# EAGLE design zif_generic (EAGLE 9.6.2)
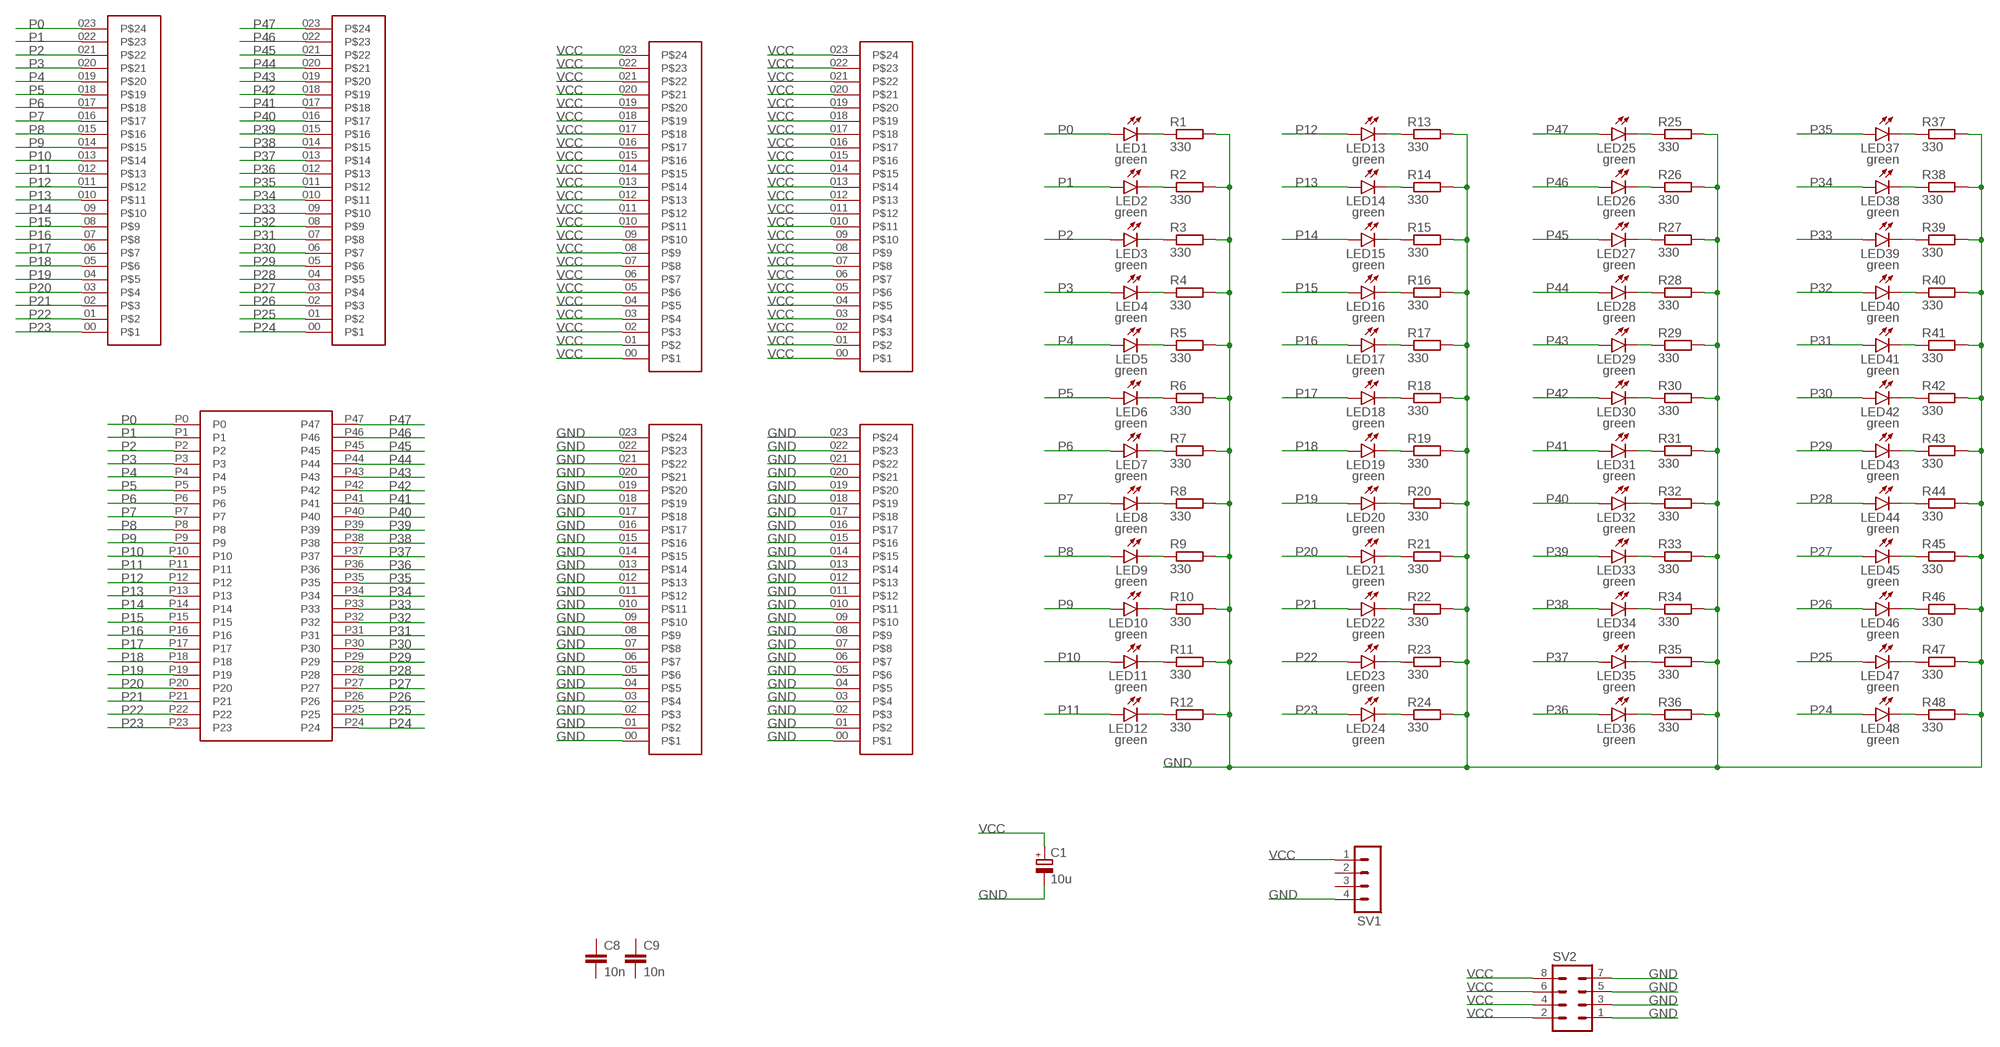
[diagram p0: schematic, sheet 1]

## Parts
C1  10u  CPOL-EUE5-8.5  [E5-8,5]
C8  10n  C-EU050-025X075  [C050-025X075]
C9  10n  C-EU050-025X075  [C050-025X075]
LED1  green  LEDSML1206  [SML1206]
LED2  green  LEDSML1206  [SML1206]
LED3  green  LEDSML1206  [SML1206]
LED4  green  LEDSML1206  [SML1206]
LED5  green  LEDSML1206  [SML1206]
LED6  green  LEDSML1206  [SML1206]
LED7  green  LEDSML1206  [SML1206]
LED8  green  LEDSML1206  [SML1206]
LED9  green  LEDSML1206  [SML1206]
LED10  green  LEDSML1206  [SML1206]
LED11  green  LEDSML1206  [SML1206]
LED12  green  LEDSML1206  [SML1206]
LED13  green  LEDSML1206  [SML1206]
LED14  green  LEDSML1206  [SML1206]
LED15  green  LEDSML1206  [SML1206]
LED16  green  LEDSML1206  [SML1206]
LED17  green  LEDSML1206  [SML1206]
LED18  green  LEDSML1206  [SML1206]
LED19  green  LEDSML1206  [SML1206]
LED20  green  LEDSML1206  [SML1206]
LED21  green  LEDSML1206  [SML1206]
LED22  green  LEDSML1206  [SML1206]
LED23  green  LEDSML1206  [SML1206]
LED24  green  LEDSML1206  [SML1206]
LED25  green  LEDSML1206  [SML1206]
LED26  green  LEDSML1206  [SML1206]
LED27  green  LEDSML1206  [SML1206]
LED28  green  LEDSML1206  [SML1206]
LED29  green  LEDSML1206  [SML1206]
LED30  green  LEDSML1206  [SML1206]
LED31  green  LEDSML1206  [SML1206]
LED32  green  LEDSML1206  [SML1206]
LED33  green  LEDSML1206  [SML1206]
LED34  green  LEDSML1206  [SML1206]
LED35  green  LEDSML1206  [SML1206]
LED36  green  LEDSML1206  [SML1206]
LED37  green  LEDSML1206  [SML1206]
LED38  green  LEDSML1206  [SML1206]
LED39  green  LEDSML1206  [SML1206]
LED40  green  LEDSML1206  [SML1206]
LED41  green  LEDSML1206  [SML1206]
LED42  green  LEDSML1206  [SML1206]
LED43  green  LEDSML1206  [SML1206]
LED44  green  LEDSML1206  [SML1206]
LED45  green  LEDSML1206  [SML1206]
LED46  green  LEDSML1206  [SML1206]
LED47  green  LEDSML1206  [SML1206]
LED48  green  LEDSML1206  [SML1206]
R1  330  R-EU_R0805  [R0805]
R2  330  R-EU_R0805  [R0805]
R3  330  R-EU_R0805  [R0805]
R4  330  R-EU_R0805  [R0805]
R5  330  R-EU_R0805  [R0805]
R6  330  R-EU_R0805  [R0805]
R7  330  R-EU_R0805  [R0805]
R8  330  R-EU_R0805  [R0805]
R9  330  R-EU_R0805  [R0805]
R10  330  R-EU_R0805  [R0805]
R11  330  R-EU_R0805  [R0805]
R12  330  R-EU_R0805  [R0805]
R13  330  R-EU_R0805  [R0805]
R14  330  R-EU_R0805  [R0805]
R15  330  R-EU_R0805  [R0805]
R16  330  R-EU_R0805  [R0805]
R17  330  R-EU_R0805  [R0805]
R18  330  R-EU_R0805  [R0805]
R19  330  R-EU_R0805  [R0805]
R20  330  R-EU_R0805  [R0805]
R21  330  R-EU_R0805  [R0805]
R22  330  R-EU_R0805  [R0805]
R23  330  R-EU_R0805  [R0805]
R24  330  R-EU_R0805  [R0805]
R25  330  R-EU_R0805  [R0805]
R26  330  R-EU_R0805  [R0805]
R27  330  R-EU_R0805  [R0805]
R28  330  R-EU_R0805  [R0805]
R29  330  R-EU_R0805  [R0805]
R30  330  R-EU_R0805  [R0805]
R31  330  R-EU_R0805  [R0805]
R32  330  R-EU_R0805  [R0805]
R33  330  R-EU_R0805  [R0805]
R34  330  R-EU_R0805  [R0805]
R35  330  R-EU_R0805  [R0805]
R36  330  R-EU_R0805  [R0805]
R37  330  R-EU_R0805  [R0805]
R38  330  R-EU_R0805  [R0805]
R39  330  R-EU_R0805  [R0805]
R40  330  R-EU_R0805  [R0805]
R41  330  R-EU_R0805  [R0805]
R42  330  R-EU_R0805  [R0805]
R43  330  R-EU_R0805  [R0805]
R44  330  R-EU_R0805  [R0805]
R45  330  R-EU_R0805  [R0805]
R46  330  R-EU_R0805  [R0805]
R47  330  R-EU_R0805  [R0805]
R48  330  R-EU_R0805  [R0805]
SV1  MA04-1  [MA04-1]
SV2  MA04-2  [MA04-2]
U$1  PIN_1X24  [PIN_1X24]
U$2  PIN_1X24  [PIN_1X24]
U$3  PIN_1X24  [PIN_1X24]
U$4  PIN_1X24  [PIN_1X24]
U$5  PIN_1X24  [PIN_1X24]
U$6  PIN_1X24  [PIN_1X24]
U$7  ZIF_24X2  [ZIF_24X2]

## Nets
GND [Supply]: C1.- R1.2 R2.2 R3.2 R4.2 R5.2 R6.2 R7.2 R8.2 R9.2 R10.2 R11.2 R12.2 R13.2 R14.2 R15.2 R16.2 R17.2 R18.2 R19.2 R20.2 R21.2 R22.2 R23.2 R24.2 R25.2 R26.2 R27.2 R28.2 R29.2 R30.2 R31.2 R32.2 R33.2 R34.2 R35.2 R36.2 R37.2 R38.2 R39.2 R40.2 R41.2 R42.2 R43.2 R44.2 R45.2 R46.2 R47.2 R48.2 SV1.4 SV2.1 SV2.3 SV2.5 SV2.7 U$2.00 U$2.01 U$2.02 U$2.03 U$2.04 U$2.05 U$2.06 U$2.07 U$2.08 U$2.09 U$2.010 U$2.011 U$2.012 U$2.013 U$2.014 U$2.015 U$2.016 U$2.017 U$2.018 U$2.019 U$2.020 U$2.021 U$2.022 U$2.023 U$5.00 U$5.01 U$5.02 U$5.03 U$5.04 U$5.05 U$5.06 U$5.07 U$5.08 U$5.09 U$5.010 U$5.011 U$5.012 U$5.013 U$5.014 U$5.015 U$5.016 U$5.017 U$5.018 U$5.019 U$5.020 U$5.021 U$5.022 U$5.023
N$1: LED1.C R1.1
N$2: LED2.C R2.1
N$3: LED3.C R3.1
N$4: LED4.C R4.1
N$5: LED5.C R5.1
N$6: LED6.C R6.1
N$7: LED7.C R7.1
N$8: LED8.C R8.1
N$9: LED9.C R9.1
N$10: LED10.C R10.1
N$11: LED11.C R11.1
N$12: LED12.C R12.1
N$13: LED13.C R13.1
N$14: LED14.C R14.1
N$15: LED15.C R15.1
N$16: LED16.C R16.1
N$17: LED17.C R17.1
N$18: LED18.C R18.1
N$19: LED19.C R19.1
N$20: LED20.C R20.1
N$21: LED21.C R21.1
N$22: LED22.C R22.1
N$23: LED23.C R23.1
N$24: LED24.C R24.1
N$25: LED25.C R25.1
N$26: LED26.C R26.1
N$27: LED27.C R27.1
N$28: LED28.C R28.1
N$29: LED29.C R29.1
N$30: LED30.C R30.1
N$31: LED31.C R31.1
N$32: LED32.C R32.1
N$33: LED33.C R33.1
N$34: LED34.C R34.1
N$35: LED35.C R35.1
N$36: LED36.C R36.1
N$37: LED37.C R37.1
N$38: LED38.C R38.1
N$39: LED39.C R39.1
N$40: LED40.C R40.1
N$41: LED41.C R41.1
N$42: LED42.C R42.1
N$43: LED43.C R43.1
N$44: LED44.C R44.1
N$45: LED45.C R45.1
N$46: LED46.C R46.1
N$47: LED47.C R47.1
N$48: LED48.C R48.1
P0: LED1.A U$4.023 U$7.P0
P1: LED2.A U$4.022 U$7.P1
P2: LED3.A U$4.021 U$7.P2
P3: LED4.A U$4.020 U$7.P3
P4: LED5.A U$4.019 U$7.P4
P5: LED6.A U$4.018 U$7.P5
P6: LED7.A U$4.017 U$7.P6
P7: LED8.A U$4.016 U$7.P7
P8: LED9.A U$4.015 U$7.P8
P9: LED10.A U$4.014 U$7.P9
P10: LED11.A U$4.013 U$7.P10
P11: LED12.A U$4.012 U$7.P11
P12: LED13.A U$4.011 U$7.P12
P13: LED14.A U$4.010 U$7.P13
P14: LED15.A U$4.09 U$7.P14
P15: LED16.A U$4.08 U$7.P15
P16: LED17.A U$4.07 U$7.P16
P17: LED18.A U$4.06 U$7.P17
P18: LED19.A U$4.05 U$7.P18
P19: LED20.A U$4.04 U$7.P19
P20: LED21.A U$4.03 U$7.P20
P21: LED22.A U$4.02 U$7.P21
P22: LED23.A U$4.01 U$7.P22
P23: LED24.A U$4.00 U$7.P23
P24: LED48.A U$1.00 U$7.P24
P25: LED47.A U$1.01 U$7.P25
P26: LED46.A U$1.02 U$7.P26
P27: LED45.A U$1.03 U$7.P27
P28: LED44.A U$1.04 U$7.P28
P29: LED43.A U$1.05 U$7.P29
P30: LED42.A U$1.06 U$7.P30
P31: LED41.A U$1.07 U$7.P31
P32: LED40.A U$1.08 U$7.P32
P33: LED39.A U$1.09 U$7.P33
P34: LED38.A U$1.010 U$7.P34
P35: LED37.A U$1.011 U$7.P35
P36: LED36.A U$1.012 U$7.P36
P37: LED35.A U$1.013 U$7.P37
P38: LED34.A U$1.014 U$7.P38
P39: LED33.A U$1.015 U$7.P39
P40: LED32.A U$1.016 U$7.P40
P41: LED31.A U$1.017 U$7.P41
P42: LED30.A U$1.018 U$7.P42
P43: LED29.A U$1.019 U$7.P43
P44: LED28.A U$1.020 U$7.P44
P45: LED27.A U$1.021 U$7.P45
P46: LED26.A U$1.022 U$7.P46
P47: LED25.A U$1.023 U$7.P47
VCC [Supply]: C1.+ SV1.1 SV2.2 SV2.4 SV2.6 SV2.8 U$3.00 U$3.01 U$3.02 U$3.03 U$3.04 U$3.05 U$3.06 U$3.07 U$3.08 U$3.09 U$3.010 U$3.011 U$3.012 U$3.013 U$3.014 U$3.015 U$3.016 U$3.017 U$3.018 U$3.019 U$3.020 U$3.021 U$3.022 U$3.023 U$6.00 U$6.01 U$6.02 U$6.03 U$6.04 U$6.05 U$6.06 U$6.07 U$6.08 U$6.09 U$6.010 U$6.011 U$6.012 U$6.013 U$6.014 U$6.015 U$6.016 U$6.017 U$6.018 U$6.019 U$6.020 U$6.021 U$6.022 U$6.023
Unconnected: C8.1 C8.2 C9.1 C9.2 SV1.2 SV1.3

## Library data of the parts
C1 = rcl:CPOL-EU: POLARIZED CAPACITOR, European symbol; SPICEPREFIX: C
C8 C9 = rcl:C-EU: CAPACITOR, European symbol; SPICEPREFIX: C
LED1-LED48 = led:LED: LED OSRAM: - CHIPLED LG R971, LG N971, LY N971, LG Q971, LY Q971, LO R971, LY R971 LH N974, LH R974 LS Q976, LO Q976, LY Q976 LO Q996 - Hyper CHIPLED LW Q18S LB Q993, LB Q99A, LB R99A - SideLED LS A670, LO A670, LY A670, LG A670, LP A670 LB A673, LV A673, LT A673, LW A673 LH A674 LY A675 LS A676, LA A676, LO A676, LY A676, LW A676 LS A679, LY A679, LG A679 - Hyper Micro SIDELED® LS Y876, LA Y876, LO Y876, LY Y876 LT Y87S - SmartLED LW L88C, LW L88S LB L89C, LB L89S, LG L890 LS L89K, LO L89K, LY L89K LS L896, LA L896, LO L896, LY L896 - TOPLED LS T670, LO T670, LY T670, LG T670, LP T670 LSG T670, LSP T670, LSY T670, LOP T670, LYG T670 LG T671, LOG T671, LSG T671 LB T673, LV T673, LT T673, LW T673 LH T674 LS T676, LA T676, LO T676, LY T676, LB T676, LH T676, LSB T676, LW T676 LB T67C, LV T67C, LT T67C, LS T67K, LO T67K, LY T67K, LW E67C LS E67B, LA E67B, LO E67B, LY E67B, LB E67C, LV E67C, LT E67C LW T67C LS T679, LY T679, LG T679 LS T770, LO T770, LY T770, LG T770, LP T770 LB T773, LV T773, LT T773, LW T773 LH T774 LS E675, LA E675, LY E675, LS T675 LS T776, LA T776, LO T776, LY T776, LB T776 LHGB T686 LT T68C, LB T68C - Hyper Mini TOPLED® LB M676 - Mini TOPLED Santana® LG M470 LS M47K, LO M47K, LY M47K Source: http://www.osram.convergy.de LUXEON: - LUMILED® LXK2-PW12-R00, LXK2-PW12-S00, LXK2-PW14-U00, LXK2-PW14-V00 LXK2-PM12-R00, LXK2-PM12-S00, LXK2-PM14-U00 LXK2-PE12-Q00, LXK2-PE12-R00, LXK2-PE12-S00, LXK2-PE14-T00, LXK2-PE14-U00 LXK2-PB12-K00, LXK2-PB12-L00, LXK2-PB12-M00, LXK2-PB14-N00, LXK2-PB14-P00, LXK2-PB14-Q00 LXK2-PR12-L00, LXK2-PR12-M00, LXK2-PR14-Q00, LXK2-PR14-R00 LXK2-PD12-Q00, LXK2-PD12-R00, LXK2-PD12-S00 LXK2-PH12-R00, LXK2-PH12-S00 LXK2-PL12-P00, LXK2-PL12-Q00, LXK2-PL12-R00 Source: www.luxeon.com KINGBRIGHT: KA-3528ASYC Source: www.kingbright.com
R1-R48 = rcl:R-EU_: RESISTOR, European symbol; SPICEPREFIX: R
SV1 = con-lstb:MA04-1: PIN HEADER; OC_FARNELL: unknown; OC_NEWARK: unknown
SV2 = con-lstb:MA04-2: PIN HEADER; OC_FARNELL: unknown; OC_NEWARK: unknown
U$1-U$6 = IsaacAlonso:PIN_1X24
U$7 = IsaacAlonso:ZIF_24X2

## Net classes
1 Supply: width 1.27 mm

## Board
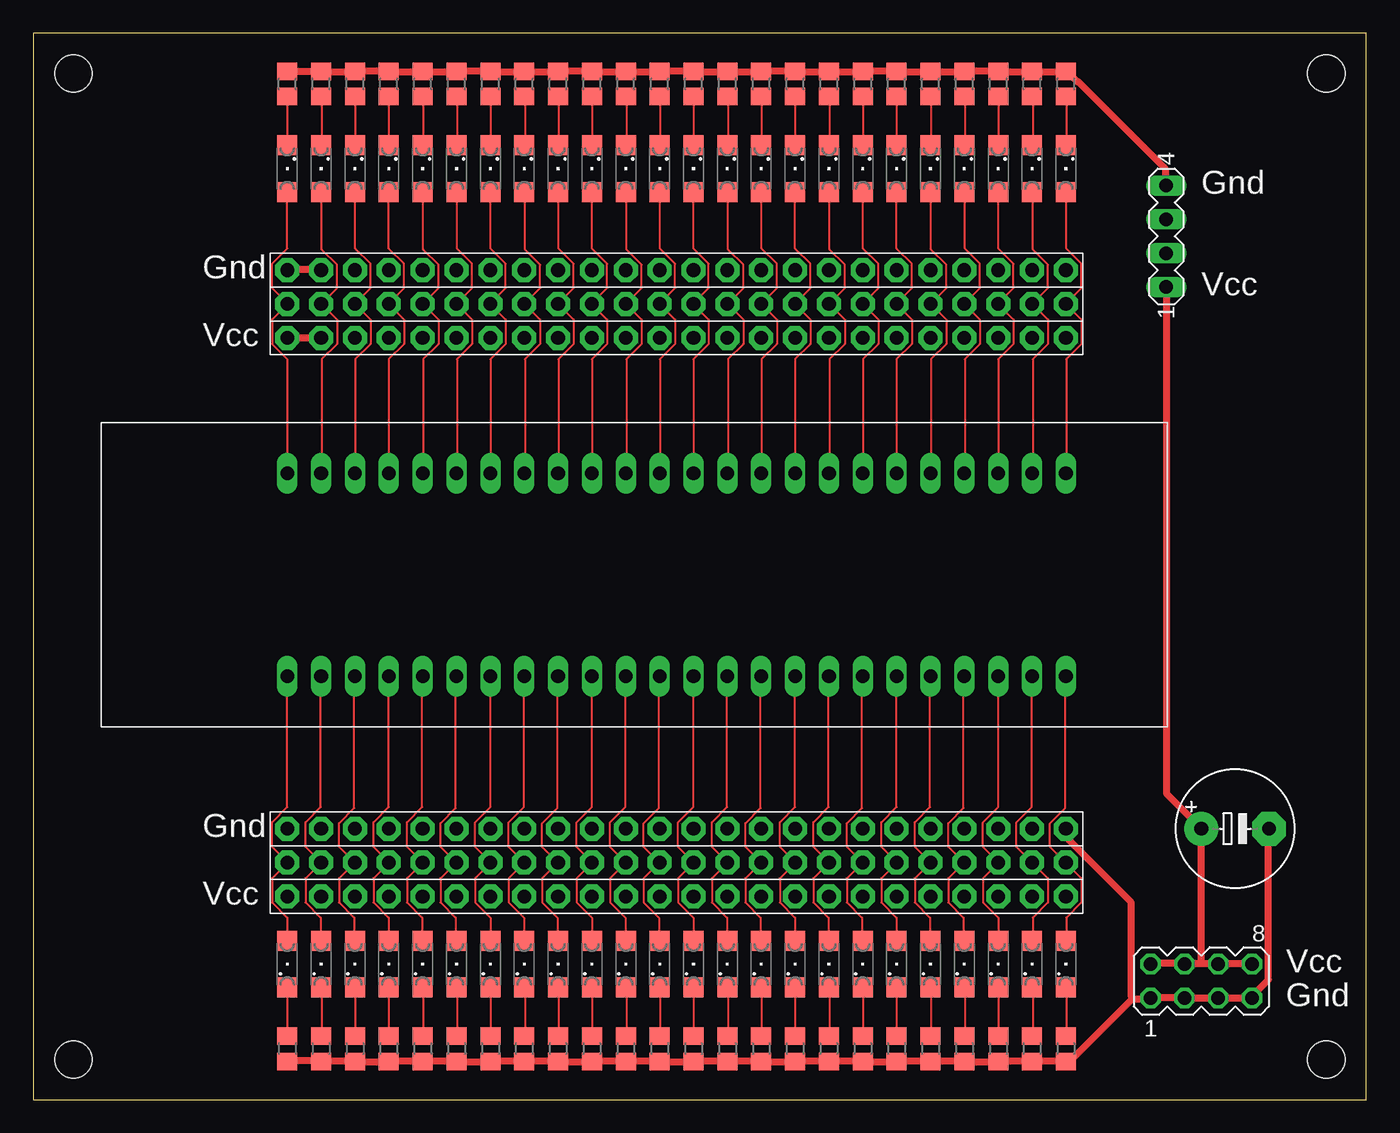
[diagram p1: board, top side]
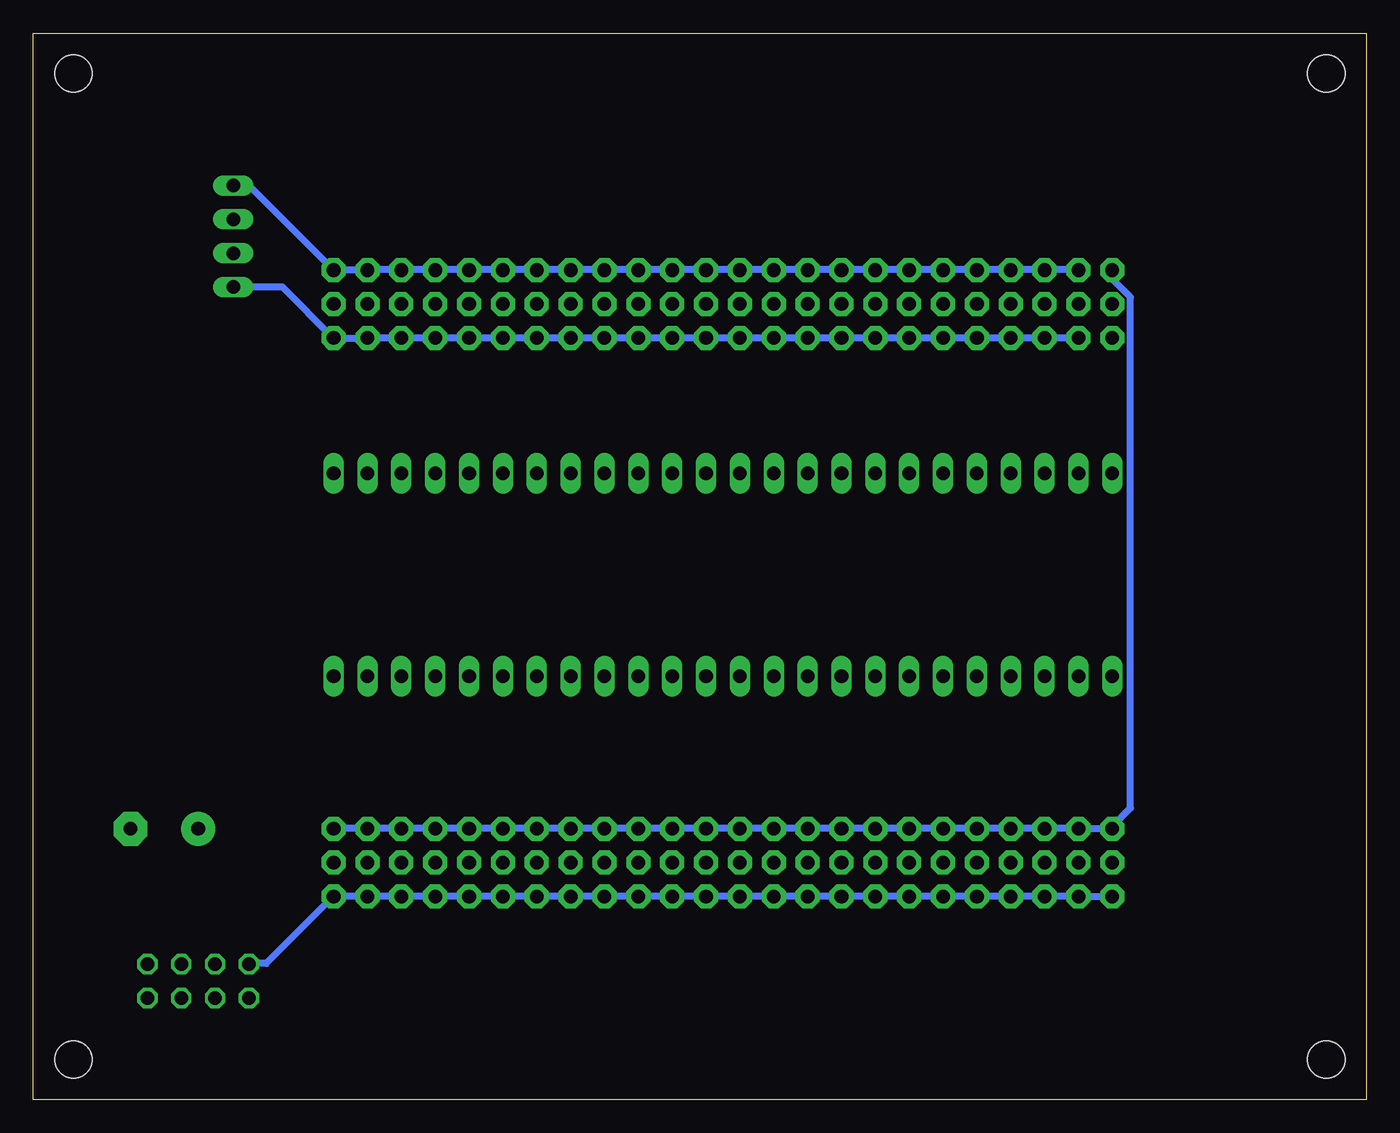
[diagram p2: board, bottom side, seen from below]

Size 100 x 80 mm. Coordinates in mm from the lower left corner, seen from the top.
Outline: 0,0 100,0 100,80 0,80 0,0
Copper layers (1*16): Top 0.035mm / dielectric 1.5mm / Bottom 0.035mm
Design rules "default": minimum track width 6mil, minimum drill 0.35mm, track to track 6mil, track to pad 6mil, pad to pad 6mil, via to via 6mil, smd to smd 6mil, copper to edge 40mil, drill to drill 6mil, minimum pad ring 10mil, minimum via ring 8mil, stop-mask expansion 4mil, vias tented up to drill 0mil, thermal gap 10mil
Holes 2.8 mm at 3,77 97,77 3,3 97,3

### Footprints (pad centres in the part's own frame; a part is rotated, then mirrored left to right if it is on the bottom)
E5-8,5 = drill 1.016 pad 2.54: + -2.54,0 | drill 1.016 pad 2.54 octagon: - 2.54,0
SML1206 = smd 1.5 x 1.5: A 1.75,0; C -1.75,0
R0805 = smd 1.3 x 1.5: 1 -0.95,0; 2 0.95,0
MA04-1 = drill 1.016 long: 1 -3.81,0; 2 -1.27,0; 3 1.27,0; 4 3.81,0
MA04-2 = drill 1.016 octagon: 1 -3.81,-1.27; 2 -3.81,1.27; 3 -1.27,-1.27; 4 -1.27,1.27; 5 1.27,-1.27; 6 1.27,1.27; 7 3.81,-1.27; 8 3.81,1.27
PIN_1X24 = drill 1.02 pad 1.8 octagon: 00 0,-31.75; 01 0,-29.21; 02 0,-26.67; 03 0,-24.13; 04 0,-21.59; 05 0,-19.05; 06 0,-16.51; 07 0,-13.97; 08 0,-11.43; 09 0,-8.89; 010 0,-6.35; 011 0,-3.81; 012 0,-1.27; 013 0,1.27; 014 0,3.81; 015 0,6.35; 016 0,8.89; 017 0,11.43; 018 0,13.97; 019 0,16.51; 020 0,19.05; 021 0,21.59; 022 0,24.13; 023 0,26.67
ZIF_24X2 = drill 1.02 long: P0 3.81,66.04; P1 3.81,63.5; P2 3.81,60.96; P3 3.81,58.42; P4 3.81,55.88; P5 3.81,53.34; P6 3.81,50.8; P7 3.81,48.26; P8 3.81,45.72; P9 3.81,43.18; P10 3.81,40.64; P11 3.81,38.1; P12 3.81,35.56; P13 3.81,33.02; P14 3.81,30.48; P15 3.81,27.94; P16 3.81,25.4; P17 3.81,22.86; P18 3.81,20.32; P19 3.81,17.78; P20 3.81,15.24; P21 3.81,12.7; P22 3.81,10.16; P23 3.81,7.62; P24 19.05,7.62; P25 19.05,10.16; P26 19.05,12.7; P27 19.05,15.24; P28 19.05,17.78; P29 19.05,20.32; P30 19.05,22.86; P31 19.05,25.4; P32 19.05,27.94; P33 19.05,30.48; P34 19.05,33.02; P35 19.05,35.56; P36 19.05,38.1; P37 19.05,40.64; P38 19.05,43.18; P39 19.05,45.72; P40 19.05,48.26; P41 19.05,50.8; P42 19.05,53.34; P43 19.05,55.88; P44 19.05,58.42; P45 19.05,60.96; P46 19.05,63.5; P47 19.05,66.04

### Placement (x,y rotation side)
C1  90.17,20.32 0 top
LED1  19.05,10.16 90 top
LED2  21.59,10.16 90 top
LED3  24.13,10.16 90 top
LED4  26.67,10.16 90 top
LED5  29.21,10.16 90 top
LED6  31.75,10.16 90 top
LED7  34.29,10.16 90 top
LED8  36.83,10.16 90 top
LED9  39.37,10.16 90 top
LED10  41.91,10.16 90 top
LED11  44.45,10.16 90 top
LED12  46.99,10.16 90 top
LED13  49.53,10.16 90 top
LED14  52.07,10.16 90 top
LED15  54.61,10.16 90 top
LED16  57.15,10.16 90 top
LED17  59.69,10.16 90 top
LED18  62.23,10.16 90 top
LED19  64.77,10.16 90 top
LED20  67.31,10.16 90 top
LED21  69.85,10.16 90 top
LED22  72.39,10.16 90 top
LED23  74.93,10.16 90 top
LED24  77.47,10.16 90 top
LED25  19.05,69.85 270 top
LED26  21.59,69.85 270 top
LED27  24.13,69.85 270 top
LED28  26.67,69.85 270 top
LED29  29.21,69.85 270 top
LED30  31.75,69.85 270 top
LED31  34.29,69.85 270 top
LED32  36.83,69.85 270 top
LED33  39.37,69.85 270 top
LED34  41.91,69.85 270 top
LED35  44.45,69.85 270 top
LED36  46.99,69.85 270 top
LED37  49.53,69.85 270 top
LED38  52.07,69.85 270 top
LED39  54.61,69.85 270 top
LED40  57.15,69.85 270 top
LED41  59.69,69.85 270 top
LED42  62.23,69.85 270 top
LED43  64.77,69.85 270 top
LED44  67.31,69.85 270 top
LED45  69.85,69.85 270 top
LED46  72.39,69.85 270 top
LED47  74.93,69.85 270 top
LED48  77.47,69.85 270 top
R1  19.05,3.81 270 top
R2  21.59,3.81 270 top
R3  24.13,3.81 270 top
R4  26.67,3.81 270 top
R5  29.21,3.81 270 top
R6  31.75,3.81 270 top
R7  34.29,3.81 270 top
R8  36.83,3.81 270 top
R9  39.37,3.81 270 top
R10  41.91,3.81 270 top
R11  44.45,3.81 270 top
R12  46.99,3.81 270 top
R13  49.53,3.81 270 top
R14  52.07,3.81 270 top
R15  54.61,3.81 270 top
R16  57.15,3.81 270 top
R17  59.69,3.81 270 top
R18  62.23,3.81 270 top
R19  64.77,3.81 270 top
R20  67.31,3.81 270 top
R21  69.85,3.81 270 top
R22  72.39,3.81 270 top
R23  74.93,3.81 270 top
R24  77.47,3.81 270 top
R25  19.05,76.2 90 top
R26  21.59,76.2 90 top
R27  24.13,76.2 90 top
R28  26.67,76.2 90 top
R29  29.21,76.2 90 top
R30  31.75,76.2 90 top
R31  34.29,76.2 90 top
R32  36.83,76.2 90 top
R33  39.37,76.2 90 top
R34  41.91,76.2 90 top
R35  44.45,76.2 90 top
R36  46.99,76.2 90 top
R37  49.53,76.2 90 top
R38  52.07,76.2 90 top
R39  54.61,76.2 90 top
R40  57.15,76.2 90 top
R41  59.69,76.2 90 top
R42  62.23,76.2 90 top
R43  64.77,76.2 90 top
R44  67.31,76.2 90 top
R45  69.85,76.2 90 top
R46  72.39,76.2 90 top
R47  74.93,76.2 90 top
R48  77.47,76.2 90 top
SV1  85,64.77 90 top
SV2  87.63,8.89 0 top
U$1  45.72,59.69 90 top
U$2  45.72,20.32 90 top
U$3  45.72,15.24 90 top
U$4  45.72,17.78 90 top
U$5  45.72,62.23 90 top
U$6  45.72,57.15 90 top
U$7  85.09,27.94 90 top

### Tracks (layer width: path | path; a pad name or v marks a point on that pad's centre or on a via)
GND
  Top 0.508: R25.2 19.05,77.11 21.57,77.11 R26.2 21.79,77.11 24.08,77.11 R27.2 24.38,77.19 26.67,77.19 R28.2 26.9,77.11 29.18,77.11 R29.2 29.41,77.11 31.7,77.11 R30.2 32,77.19 34.29,77.19 R31.2 34.52,77.11 36.8,77.11 R32.2 37.03,77.11 39.32,77.11 R33.2 39.62,77.19 41.91,77.19 R34.2 42.14,77.11 44.42,77.11 R35.2 44.65,77.11 46.94,77.11 R36.2 47.24,77.19 49.53,77.19 R37.2 49.76,77.11 52.05,77.11 R38.2 52.27,77.11 54.56,77.11 R39.2 54.86,77.19 57.15,77.19 R40.2 57.38,77.11 59.66,77.11 R41.2 59.89,77.11 62.18,77.11 R42.2 62.48,77.19 64.77,77.19 R43.2 65,77.11 67.28,77.11 R44.2 67.51,77.11 69.8,77.11 R45.2 70.1,77.19 72.39,77.19 R46.2 72.62,77.11 74.91,77.11 R47.2 75.13,77.11 77.42,77.11 R48.2 77.65,77.04 78.33,76.35 78.41,76.35 84.96,69.8 84.96,68.58 SV1.4 | U$5.023 19.05,62.26 21.57,62.26 U$5.022 | C1.- 92.66,20.27 92.66,8.99 91.52,7.85 SV2.7 SV2.5 SV2.3 SV2.1 83.59,7.54 82.45,7.54 | R1.2 19.05,2.9 21.57,2.9 R2.2 21.79,2.9 24.08,2.9 R3.2 24.38,2.82 26.67,2.82 R4.2 26.9,2.9 29.18,2.9 R5.2 29.41,2.9 31.7,2.9 R6.2 32,2.82 34.29,2.82 R7.2 34.52,2.9 36.8,2.9 R8.2 37.03,2.9 39.32,2.9 R9.2 39.62,2.82 41.91,2.82 R10.2 42.14,2.9 44.42,2.9 R11.2 44.65,2.9 46.94,2.9 R12.2 47.24,2.82 49.53,2.82 R13.2 49.76,2.9 52.05,2.9 R14.2 52.27,2.9 54.56,2.9 R15.2 54.86,2.82 57.15,2.82 R16.2 57.38,2.9 59.66,2.9 R17.2 59.89,2.9 62.18,2.9 R18.2 62.48,2.82 64.77,2.82 R19.2 65,2.9 67.28,2.9 R20.2 67.51,2.9 69.8,2.9 R21.2 70.1,2.82 72.39,2.82 R22.2 72.62,2.9 74.91,2.9 R23.2 75.13,2.9 77.42,2.9 R24.2 77.72,2.82 82.45,7.54 | U$2.00 77.5,20.27 77.5,19.66 82.37,14.78 82.37,7.77 82.45,7.54
  Bottom 0.508: SV1.4 83.82,68.58 U$5.00 77.27,62.26 74.98,62.26 U$5.01 74.68,62.26 72.62,62.26 U$5.02 72.39,62.26 70.1,62.26 U$5.03 69.8,62.26 67.51,62.26 U$5.04 67.28,62.26 65,62.26 U$5.05 64.77,62.26 62.48,62.26 U$5.06 62.18,62.26 59.89,62.26 U$5.07 59.66,62.26 57.38,62.26 U$5.08 57.15,62.26 54.86,62.26 U$5.09 54.56,62.26 52.27,62.26 U$5.010 52.05,62.26 49.76,62.26 U$5.011 49.53,62.26 47.24,62.26 U$5.012 46.94,62.26 44.65,62.26 U$5.013 44.42,62.26 42.14,62.26 U$5.014 41.91,62.26 39.62,62.26 U$5.015 39.32,62.26 37.03,62.26 U$5.016 36.8,62.26 34.52,62.26 U$5.017 34.29,62.26 32,62.26 U$5.018 31.7,62.26 29.41,62.26 U$5.019 29.18,62.26 26.9,62.26 U$5.020 26.67,62.26 24.38,62.26 U$5.021 24.08,62.26 21.64,62.26 U$5.022 | U$2.00 77.42,20.34 75.13,20.34 U$2.01 74.91,20.34 72.62,20.34 U$2.02 72.39,20.34 70.1,20.34 U$2.03 69.8,20.34 67.51,20.34 U$2.04 67.28,20.34 65,20.34 U$2.05 64.77,20.34 62.48,20.34 U$2.06 62.18,20.34 59.89,20.34 U$2.07 59.66,20.34 57.38,20.34 U$2.08 57.15,20.34 54.86,20.34 U$2.09 54.56,20.34 52.27,20.34 U$2.010 52.05,20.34 49.76,20.34 U$2.011 49.53,20.34 47.24,20.34 U$2.012 46.94,20.34 44.65,20.34 U$2.013 44.42,20.34 42.14,20.34 U$2.014 41.91,20.34 39.62,20.34 U$2.015 39.32,20.34 37.03,20.34 U$2.016 36.8,20.34 34.52,20.34 U$2.017 34.29,20.34 32,20.34 U$2.018 31.7,20.34 29.41,20.34 U$2.019 29.18,20.34 26.9,20.34 U$2.020 26.67,20.34 24.38,20.34 U$2.021 24.08,20.34 21.79,20.34 U$2.022 21.57,20.34 19.05,20.34 U$2.023 18.97,20.57 17.68,21.87 17.68,60.2 19.05,61.57 U$5.023
N$1
  Top 0.152: LED1.C R1.1
N$2
  Top 0.152: R2.1 21.64,4.8 21.64,8.38 LED2.C
N$3
  Top 0.152: R3.1 24.16,4.8 24.16,8.38 LED3.C
N$4
  Top 0.152: LED4.C R4.1
N$5
  Top 0.152: R5.1 29.26,4.8 29.26,8.38 LED5.C
N$6
  Top 0.152: R6.1 31.77,4.8 31.77,8.38 LED6.C
N$7
  Top 0.152: LED7.C R7.1
N$8
  Top 0.152: R8.1 36.88,4.8 36.88,8.38 LED8.C
N$9
  Top 0.152: R9.1 39.4,4.8 39.4,8.38 LED9.C
N$10
  Top 0.152: LED10.C R10.1
N$11
  Top 0.152: R11.1 44.5,4.8 44.5,8.38 LED11.C
N$12
  Top 0.152: R12.1 47.02,4.8 47.02,8.38 LED12.C
N$13
  Top 0.152: LED13.C R13.1
N$14
  Top 0.152: R14.1 52.12,4.8 52.12,8.38 LED14.C
N$15
  Top 0.152: R15.1 54.63,4.8 54.63,8.38 LED15.C
N$16
  Top 0.152: LED16.C R16.1
N$17
  Top 0.152: R17.1 59.74,4.8 59.74,8.38 LED17.C
N$18
  Top 0.152: R18.1 62.26,4.8 62.26,8.38 LED18.C
N$19
  Top 0.152: LED19.C R19.1
N$20
  Top 0.152: R20.1 67.36,4.8 67.36,8.38 LED20.C
N$21
  Top 0.152: R21.1 69.88,4.8 69.88,8.38 LED21.C
N$22
  Top 0.152: LED22.C R22.1
N$23
  Top 0.152: R23.1 74.98,4.8 74.98,8.38 LED23.C
N$24
  Top 0.152: R24.1 77.5,4.8 77.5,8.38 LED24.C
N$25
  Top 0.152: R25.1 LED25.C
N$26
  Top 0.152: LED26.C 21.64,71.63 21.64,75.21 R26.1
N$27
  Top 0.152: LED27.C 24.16,71.63 24.16,75.21 R27.1
N$28
  Top 0.152: R28.1 LED28.C
N$29
  Top 0.152: LED29.C 29.26,71.63 29.26,75.21 R29.1
N$30
  Top 0.152: LED30.C 31.77,71.63 31.77,75.21 R30.1
N$31
  Top 0.152: R31.1 LED31.C
N$32
  Top 0.152: LED32.C 36.88,71.63 36.88,75.21 R32.1
N$33
  Top 0.152: LED33.C 39.4,71.63 39.4,75.21 R33.1
N$34
  Top 0.152: R34.1 LED34.C
N$35
  Top 0.152: LED35.C 44.5,71.63 44.5,75.21 R35.1
N$36
  Top 0.152: LED36.C 47.02,71.63 47.02,75.21 R36.1
N$37
  Top 0.152: R37.1 LED37.C
N$38
  Top 0.152: LED38.C 52.12,71.63 52.12,75.21 R38.1
N$39
  Top 0.152: LED39.C 54.63,71.63 54.63,75.21 R39.1
N$40
  Top 0.152: R40.1 LED40.C
N$41
  Top 0.152: LED41.C 59.74,71.63 59.74,75.21 R41.1
N$42
  Top 0.152: LED42.C 62.26,71.63 62.26,75.21 R42.1
N$43
  Top 0.152: R43.1 LED43.C
N$44
  Top 0.152: LED44.C 67.36,71.63 67.36,75.21 R44.1
N$45
  Top 0.152: LED45.C 69.88,71.63 69.88,75.21 R45.1
N$46
  Top 0.152: R46.1 LED46.C
N$47
  Top 0.152: LED47.C 74.98,71.63 74.98,75.21 R47.1
N$48
  Top 0.152: LED48.C 77.5,71.63 77.5,75.21 R48.1
P0
  Top 0.152: LED1.A 19.05,13.64 17.91,14.78 17.91,16.61 19.05,17.75 U$4.023 19.05,17.83 17.91,18.97 17.91,20.8 19.05,21.95 U$7.P0
P1
  Top 0.152: LED2.A 21.57,11.96 21.57,13.64 20.42,14.78 20.42,16.61 U$4.022 21.57,17.83 20.42,18.97 20.42,20.8 21.57,21.95 21.57,31.7 U$7.P1
P2
  Top 0.152: LED3.A 24.08,11.96 24.08,13.64 22.94,14.78 22.94,16.61 24.08,17.75 U$4.021 22.94,18.97 22.94,20.73 24.08,21.87 24.08,31.7 U$7.P2
P3
  Top 0.152: LED4.A 26.67,13.64 25.53,14.78 25.53,16.61 26.67,17.75 U$4.020 26.67,17.83 25.53,18.97 25.53,20.8 26.67,21.95 U$7.P3
P4
  Top 0.152: LED5.A 29.18,11.96 29.18,13.64 28.04,14.78 28.04,16.61 U$4.019 29.18,17.83 28.04,18.97 28.04,20.8 29.18,21.95 29.18,31.7 U$7.P4
P5
  Top 0.152: LED6.A 31.7,11.96 31.7,13.64 30.56,14.78 30.56,16.61 31.7,17.75 U$4.018 30.56,18.97 30.56,20.73 31.7,21.87 31.7,31.7 U$7.P5
P6
  Top 0.152: LED7.A 34.29,13.64 33.15,14.78 33.15,16.61 34.29,17.75 U$4.017 34.29,17.83 33.15,18.97 33.15,20.8 34.29,21.95 U$7.P6
P7
  Top 0.152: LED8.A 36.8,11.96 36.8,13.64 35.66,14.78 35.66,16.61 U$4.016 36.8,17.83 35.66,18.97 35.66,20.8 36.8,21.95 36.8,31.7 U$7.P7
P8
  Top 0.152: LED9.A 39.32,11.96 39.32,13.64 38.18,14.78 38.18,16.61 39.32,17.75 U$4.015 38.18,18.97 38.18,20.73 39.32,21.87 39.32,31.7 U$7.P8
P9
  Top 0.152: LED10.A 41.91,13.64 40.77,14.78 40.77,16.61 41.91,17.75 U$4.014 41.91,17.83 40.77,18.97 40.77,20.8 41.91,21.95 U$7.P9
P10
  Top 0.152: LED11.A 44.42,11.96 44.42,13.64 43.28,14.78 43.28,16.61 U$4.013 44.42,17.83 43.28,18.97 43.28,20.8 44.42,21.95 44.42,31.7 U$7.P10
P11
  Top 0.152: LED12.A 46.94,11.96 46.94,13.64 45.8,14.78 45.8,16.61 46.94,17.75 U$4.012 45.8,18.97 45.8,20.73 46.94,21.87 46.94,31.7 U$7.P11
P12
  Top 0.152: LED13.A 49.53,13.64 48.39,14.78 48.39,16.61 49.53,17.75 U$4.011 49.53,17.83 48.39,18.97 48.39,20.8 49.53,21.95 U$7.P12
P13
  Top 0.152: LED14.A 52.05,11.96 52.05,13.64 50.9,14.78 50.9,16.61 U$4.010 52.05,17.83 50.9,18.97 50.9,20.8 52.05,21.95 52.05,31.7 U$7.P13
P14
  Top 0.152: LED15.A 54.56,11.96 54.56,13.64 53.42,14.78 53.42,16.61 54.56,17.75 U$4.09 53.42,18.97 53.42,20.73 54.56,21.87 54.56,31.7 U$7.P14
P15
  Top 0.152: LED16.A 57.15,13.64 56.01,14.78 56.01,16.61 57.15,17.75 U$4.08 57.15,17.83 56.01,18.97 56.01,20.8 57.15,21.95 U$7.P15
P16
  Top 0.152: LED17.A 59.66,11.96 59.66,13.64 58.52,14.78 58.52,16.61 U$4.07 59.66,17.83 58.52,18.97 58.52,20.8 59.66,21.95 59.66,31.7 U$7.P16
P17
  Top 0.152: LED18.A 62.18,11.96 62.18,13.64 61.04,14.78 61.04,16.61 62.18,17.75 U$4.06 61.04,18.97 61.04,20.73 62.18,21.87 62.18,31.7 U$7.P17
P18
  Top 0.152: LED19.A 64.77,13.64 63.63,14.78 63.63,16.61 64.77,17.75 U$4.05 64.77,17.83 63.63,18.97 63.63,20.8 64.77,21.95 U$7.P18
P19
  Top 0.152: LED20.A 67.28,11.96 67.28,13.64 66.14,14.78 66.14,16.61 U$4.04 67.28,17.83 66.14,18.97 66.14,20.8 67.28,21.95 67.28,31.7 U$7.P19
P20
  Top 0.152: LED21.A 69.8,11.96 69.8,13.64 68.66,14.78 68.66,16.61 69.8,17.75 U$4.03 68.66,18.97 68.66,20.73 69.8,21.87 69.8,31.7 U$7.P20
P21
  Top 0.152: LED22.A 72.39,13.64 71.25,14.78 71.25,16.61 72.39,17.75 U$4.02 72.39,17.83 71.25,18.97 71.25,20.8 72.39,21.95 U$7.P21
P22
  Top 0.152: LED23.A 74.98,11.96 74.98,13.64 76.12,14.78 76.12,16.61 74.98,17.75 U$4.01 74.91,17.83 73.76,18.97 73.76,20.8 74.91,21.95 74.91,31.7 U$7.P22
P23
  Top 0.152: LED24.A 77.5,11.96 77.5,13.64 78.64,14.78 78.64,16.61 U$4.00 76.28,18.97 76.28,20.73 77.42,21.87 77.42,31.7 U$7.P23
P24
  Top 0.152: LED48.A 77.5,68.05 77.5,63.86 78.64,62.71 78.64,60.88 77.5,59.74 U$1.00 78.64,58.52 78.64,56.69 77.5,55.55 77.5,47.02 U$7.P24
P25
  Top 0.152: LED47.A 74.98,68.05 74.98,63.78 76.12,62.64 76.12,60.88 U$1.01 74.98,59.66 76.12,58.52 76.12,56.69 74.98,55.55 74.98,47.02 U$7.P25
P26
  Top 0.152: LED46.A 72.39,63.86 73.53,62.71 73.53,60.88 72.39,59.74 U$1.02 72.39,59.66 73.53,58.52 73.53,56.69 72.39,55.55 U$7.P26
P27
  Top 0.152: LED45.A 69.88,68.05 69.88,63.86 71.02,62.71 71.02,60.88 69.88,59.74 U$1.03 71.02,58.52 71.02,56.69 69.88,55.55 69.88,47.02 U$7.P27
P28
  Top 0.152: LED44.A 67.36,68.05 67.36,63.78 68.5,62.64 68.5,60.88 U$1.04 67.36,59.66 68.5,58.52 68.5,56.69 67.36,55.55 67.36,47.02 U$7.P28
P29
  Top 0.152: LED43.A 64.77,63.86 65.91,62.71 65.91,60.88 64.77,59.74 U$1.05 64.77,59.66 65.91,58.52 65.91,56.69 64.77,55.55 U$7.P29
P30
  Top 0.152: LED42.A 62.26,68.05 62.26,63.86 63.4,62.71 63.4,60.88 62.26,59.74 U$1.06 63.4,58.52 63.4,56.69 62.26,55.55 62.26,47.02 U$7.P30
P31
  Top 0.152: LED41.A 59.74,68.05 59.74,63.78 60.88,62.64 60.88,60.88 U$1.07 59.74,59.66 60.88,58.52 60.88,56.69 59.74,55.55 59.74,47.02 U$7.P31
P32
  Top 0.152: LED40.A 57.15,63.86 58.29,62.71 58.29,60.88 57.15,59.74 U$1.08 57.15,59.66 58.29,58.52 58.29,56.69 57.15,55.55 U$7.P32
P33
  Top 0.152: LED39.A 54.63,68.05 54.63,63.86 55.78,62.71 55.78,60.88 54.63,59.74 U$1.09 55.78,58.52 55.78,56.69 54.63,55.55 54.63,47.02 U$7.P33
P34
  Top 0.152: LED38.A 52.12,68.05 52.12,63.78 53.26,62.64 53.26,60.88 U$1.010 52.12,59.66 53.26,58.52 53.26,56.69 52.12,55.55 52.12,47.02 U$7.P34
P35
  Top 0.152: LED37.A 49.53,63.86 50.67,62.71 50.67,60.88 49.53,59.74 U$1.011 49.53,59.66 50.67,58.52 50.67,56.69 49.53,55.55 U$7.P35
P36
  Top 0.152: LED36.A 47.02,68.05 47.02,63.86 48.16,62.71 48.16,60.88 47.02,59.74 U$1.012 48.16,58.52 48.16,56.69 47.02,55.55 47.02,47.02 U$7.P36
P37
  Top 0.152: LED35.A 44.5,68.05 44.5,63.78 45.64,62.64 45.64,60.88 U$1.013 44.5,59.66 45.64,58.52 45.64,56.69 44.5,55.55 44.5,47.02 U$7.P37
P38
  Top 0.152: LED34.A 41.91,63.86 43.05,62.71 43.05,60.88 41.91,59.74 U$1.014 41.91,59.66 43.05,58.52 43.05,56.69 41.91,55.55 U$7.P38
P39
  Top 0.152: LED33.A 39.4,68.05 39.4,63.86 40.54,62.71 40.54,60.88 39.4,59.74 U$1.015 40.54,58.52 40.54,56.69 39.4,55.55 39.4,47.02 U$7.P39
P40
  Top 0.152: LED32.A 36.88,68.05 36.88,63.78 38.02,62.64 38.02,60.88 U$1.016 36.88,59.66 38.02,58.52 38.02,56.69 36.88,55.55 36.88,47.02 U$7.P40
P41
  Top 0.152: LED31.A 34.29,63.86 35.43,62.71 35.43,60.88 34.29,59.74 U$1.017 34.29,59.66 35.43,58.52 35.43,56.69 34.29,55.55 U$7.P41
P42
  Top 0.152: LED30.A 31.77,68.05 31.77,63.86 32.92,62.71 32.92,60.88 31.77,59.74 U$1.018 32.92,58.52 32.92,56.69 31.77,55.55 31.77,47.02 U$7.P42
P43
  Top 0.152: LED29.A 29.26,68.05 29.26,63.78 30.4,62.64 30.4,60.88 U$1.019 29.26,59.66 30.4,58.52 30.4,56.69 29.26,55.55 29.26,47.02 U$7.P43
P44
  Top 0.152: LED28.A 26.67,63.86 27.81,62.71 27.81,60.88 26.67,59.74 U$1.020 26.67,59.66 27.81,58.52 27.81,56.69 26.67,55.55 U$7.P44
P45
  Top 0.152: LED27.A 24.16,68.05 24.16,63.86 25.3,62.71 25.3,60.88 24.16,59.74 U$1.021 25.3,58.52 25.3,56.69 24.16,55.55 24.16,47.02 U$7.P45
P46
  Top 0.152: LED26.A 21.64,68.05 21.64,63.78 22.78,62.64 22.78,60.88 U$1.022 21.64,59.66 22.78,58.52 22.78,56.69 21.64,55.55 21.64,47.02 U$7.P46
P47
  Top 0.152: LED25.A 19.05,63.86 17.91,62.71 17.91,60.88 19.05,59.74 U$1.023 19.05,59.66 17.91,58.52 17.91,56.69 19.05,55.55 U$7.P47
VCC
  Top 0.508: U$6.022 U$6.023 | SV2.2 83.82,10.21 86.33,10.21 SV2.4 86.56,10.21 87.63,10.21 | 87.63,10.21 88.85,10.21 SV2.6 89.08,10.21 91.44,10.21 SV2.8 | 87.63,10.21 C1.+ 87.48,20.5 85.04,22.94 85.04,60.96 SV1.1
  Bottom 0.508: SV1.1 81.31,60.96 77.5,57.15 U$6.00 U$6.01 U$6.02 U$6.03 U$6.04 U$6.05 U$6.06 U$6.07 U$6.08 U$6.09 U$6.010 U$6.011 U$6.012 U$6.013 U$6.014 U$6.015 U$6.016 U$6.017 U$6.018 U$6.019 U$6.020 U$6.021 U$6.022 | U$3.023 U$3.022 U$3.021 U$3.020 U$3.019 U$3.018 U$3.017 U$3.016 U$3.015 U$3.014 U$3.013 U$3.012 U$3.011 U$3.010 U$3.09 U$3.08 U$3.07 U$3.06 U$3.05 U$3.04 U$3.03 U$3.02 U$3.01 U$3.00 77.65,15.09 82.53,10.21 83.82,10.21 SV2.2

### Text on the board
tPlace: Gnd | Gnd | Vcc | Vcc | Gnd | Vcc | Vcc | Gnd